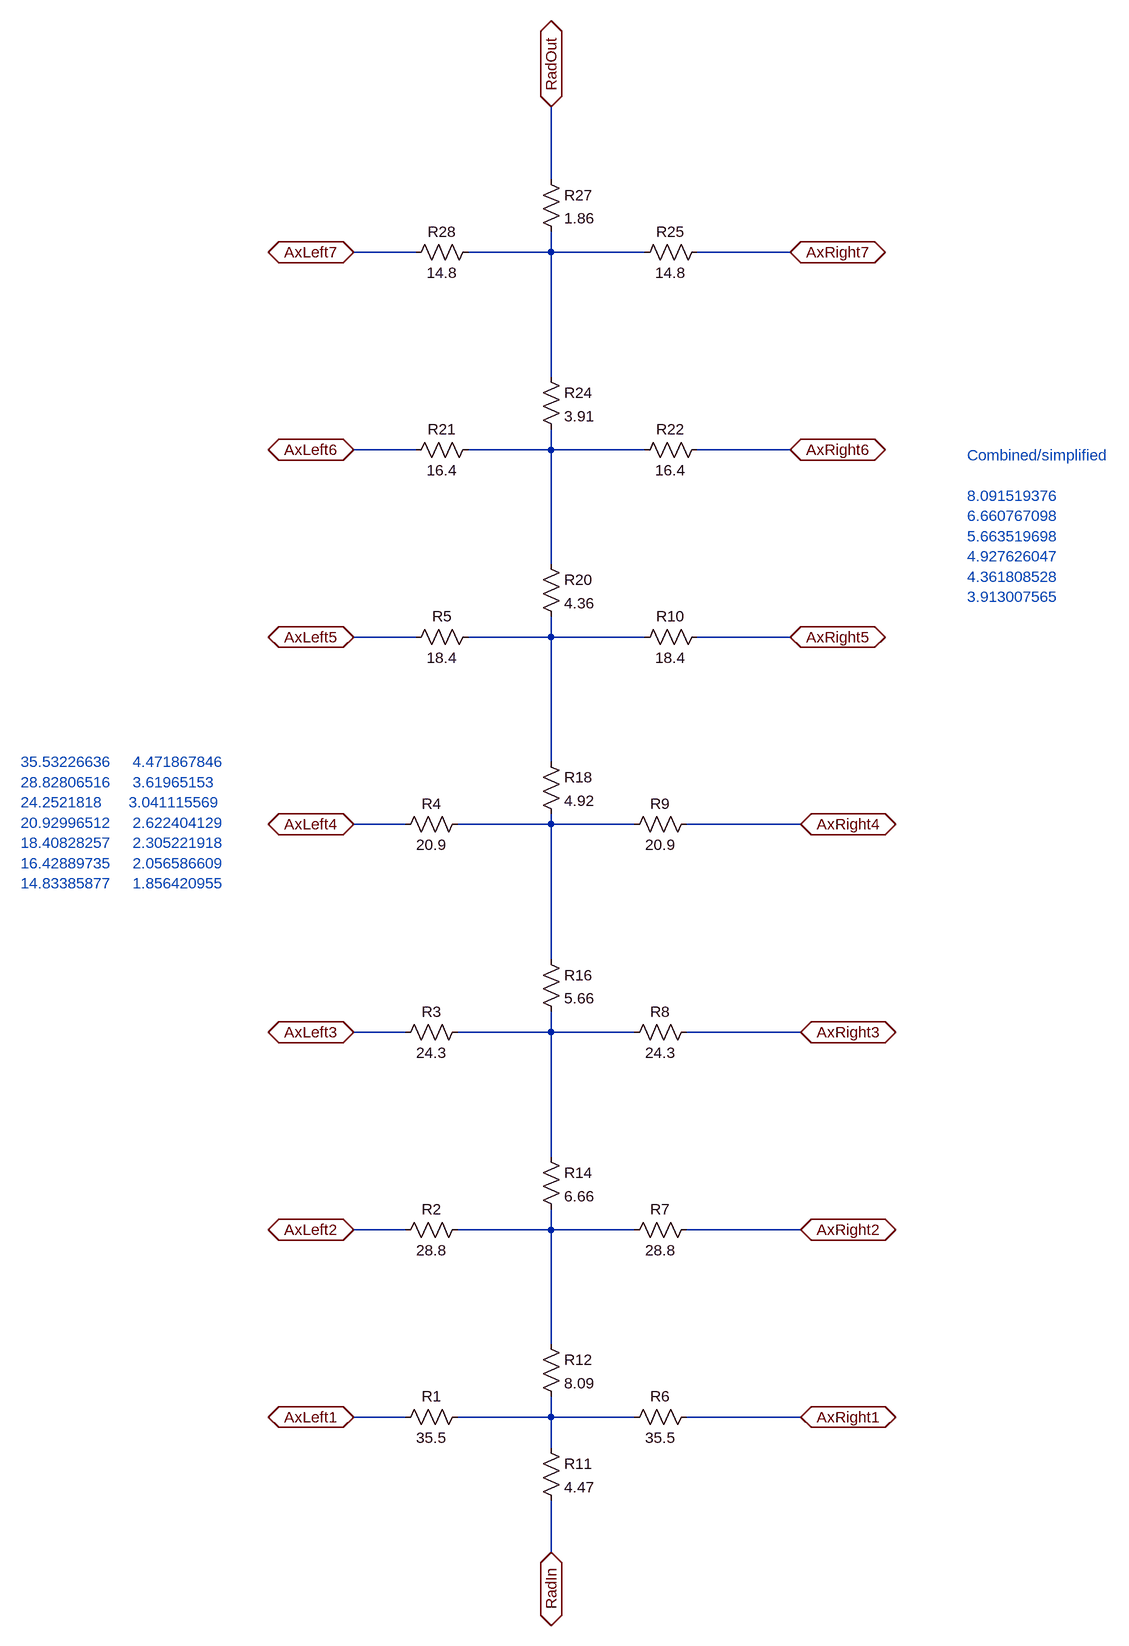
[diagram p0: schematic FarFieldResistance1mm.asc]
FarFieldResistance1mm.asc, the LTspice schematic file:
Version 4
SHEET 1 2344 744
WIRE 528 -1536 528 -1648
WIRE 320 -1424 224 -1424
WIRE 528 -1424 528 -1456
WIRE 528 -1424 400 -1424
WIRE 672 -1424 528 -1424
WIRE 896 -1424 752 -1424
WIRE 528 -1232 528 -1424
WIRE 320 -1120 224 -1120
WIRE 528 -1120 528 -1152
WIRE 528 -1120 400 -1120
WIRE 672 -1120 528 -1120
WIRE 896 -1120 752 -1120
WIRE 528 -944 528 -1120
WIRE 320 -832 224 -832
WIRE 528 -832 528 -864
WIRE 528 -832 400 -832
WIRE 672 -832 528 -832
WIRE 896 -832 752 -832
WIRE 528 -640 528 -832
WIRE 304 -544 224 -544
WIRE 528 -544 528 -560
WIRE 528 -544 384 -544
WIRE 656 -544 528 -544
WIRE 912 -544 736 -544
WIRE 528 -336 528 -544
WIRE 304 -224 224 -224
WIRE 528 -224 528 -256
WIRE 528 -224 384 -224
WIRE 656 -224 528 -224
WIRE 912 -224 736 -224
WIRE 528 -32 528 -224
WIRE 304 80 224 80
WIRE 528 80 528 48
WIRE 528 80 384 80
WIRE 656 80 528 80
WIRE 912 80 736 80
WIRE 528 256 528 80
WIRE 304 368 224 368
WIRE 528 368 528 336
WIRE 528 368 384 368
WIRE 656 368 528 368
WIRE 912 368 736 368
WIRE 528 416 528 368
WIRE 528 576 528 496
FLAG 224 368 AxLeft1
IOPIN 224 368 BiDir
FLAG 224 80 AxLeft2
IOPIN 224 80 BiDir
FLAG 224 -224 AxLeft3
IOPIN 224 -224 BiDir
FLAG 224 -544 AxLeft4
IOPIN 224 -544 BiDir
FLAG 224 -832 AxLeft5
IOPIN 224 -832 BiDir
FLAG 912 368 AxRight1
IOPIN 912 368 BiDir
FLAG 912 80 AxRight2
IOPIN 912 80 BiDir
FLAG 912 -224 AxRight3
IOPIN 912 -224 BiDir
FLAG 912 -544 AxRight4
IOPIN 912 -544 BiDir
FLAG 896 -832 AxRight5
IOPIN 896 -832 BiDir
FLAG 528 576 RadIn
IOPIN 528 576 BiDir
FLAG 224 -1120 AxLeft6
IOPIN 224 -1120 BiDir
FLAG 896 -1120 AxRight6
IOPIN 896 -1120 BiDir
FLAG 528 -1648 RadOut
IOPIN 528 -1648 BiDir
FLAG 224 -1424 AxLeft7
IOPIN 224 -1424 BiDir
FLAG 896 -1424 AxRight7
IOPIN 896 -1424 BiDir
SYMBOL res 752 352 R90
WINDOW 0 0 56 VBottom 0
WINDOW 3 32 56 VTop 0
SYMATTR InstName R6
SYMATTR Value 35.5
SYMBOL res 752 64 R90
WINDOW 0 0 56 VBottom 0
WINDOW 3 32 56 VTop 0
SYMATTR InstName R7
SYMATTR Value 28.8
SYMBOL res 752 -240 R90
WINDOW 0 0 56 VBottom 0
WINDOW 3 32 56 VTop 0
SYMATTR InstName R8
SYMATTR Value 24.3
SYMBOL res 752 -560 R90
WINDOW 0 0 56 VBottom 0
WINDOW 3 32 56 VTop 0
SYMATTR InstName R9
SYMATTR Value 20.9
SYMBOL res 768 -848 R90
WINDOW 0 0 56 VBottom 0
WINDOW 3 32 56 VTop 0
SYMATTR InstName R10
SYMATTR Value 18.4
SYMBOL res 512 400 R0
SYMATTR InstName R11
SYMATTR Value 4.47
SYMBOL res 512 240 R0
SYMATTR InstName R12
SYMATTR Value 8.09
SYMBOL res 512 -48 R0
SYMATTR InstName R14
SYMATTR Value 6.66
SYMBOL res 512 -352 R0
SYMATTR InstName R16
SYMATTR Value 5.66
SYMBOL res 512 -656 R0
SYMATTR InstName R18
SYMATTR Value 4.92
SYMBOL res 512 -960 R0
SYMATTR InstName R20
SYMATTR Value 4.36
SYMBOL res 768 -1136 R90
WINDOW 0 0 56 VBottom 0
WINDOW 3 32 56 VTop 0
SYMATTR InstName R22
SYMATTR Value 16.4
SYMBOL res 512 -1248 R0
SYMATTR InstName R24
SYMATTR Value 3.91
SYMBOL res 400 352 R90
WINDOW 0 0 56 VBottom 0
WINDOW 3 32 56 VTop 0
SYMATTR InstName R1
SYMATTR Value 35.5
SYMBOL res 400 64 R90
WINDOW 0 0 56 VBottom 0
WINDOW 3 32 56 VTop 0
SYMATTR InstName R2
SYMATTR Value 28.8
SYMBOL res 400 -240 R90
WINDOW 0 0 56 VBottom 0
WINDOW 3 32 56 VTop 0
SYMATTR InstName R3
SYMATTR Value 24.3
SYMBOL res 400 -560 R90
WINDOW 0 0 56 VBottom 0
WINDOW 3 32 56 VTop 0
SYMATTR InstName R4
SYMATTR Value 20.9
SYMBOL res 416 -848 R90
WINDOW 0 0 56 VBottom 0
WINDOW 3 32 56 VTop 0
SYMATTR InstName R5
SYMATTR Value 18.4
SYMBOL res 416 -1136 R90
WINDOW 0 0 56 VBottom 0
WINDOW 3 32 56 VTop 0
SYMATTR InstName R21
SYMATTR Value 16.4
SYMBOL res 768 -1440 R90
WINDOW 0 0 56 VBottom 0
WINDOW 3 32 56 VTop 0
SYMATTR InstName R25
SYMATTR Value 14.8
SYMBOL res 512 -1552 R0
SYMATTR InstName R27
SYMATTR Value 1.86
SYMBOL res 416 -1440 R90
WINDOW 0 0 56 VBottom 0
WINDOW 3 32 56 VTop 0
SYMATTR InstName R28
SYMATTR Value 14.8
TEXT -288 -640 Left 0 ;35.53226636     4.471867846\n28.82806516     3.61965153\n24.2521818      3.041115569\n20.92996512     2.622404129\n18.40828257     2.305221918\n16.42889735     2.056586609\n14.83385877     1.856420955
TEXT 1168 -1112 Left 0 ;Combined/simplified\n \n8.091519376\n6.660767098\n5.663519698\n4.927626047\n4.361808528\n3.913007565

The netlist it stands for:
* FarFieldResistance1mm.asc
R6 AxRight1 N007 35.5
R7 AxRight2 N006 28.8
R8 AxRight3 N005 24.3
R9 AxRight4 N004 20.9
R10 AxRight5 N003 18.4
R11 N007 RadIn 4.47
R12 N006 N007 8.09
R14 N005 N006 6.66
R16 N004 N005 5.66
R18 N003 N004 4.92
R20 N002 N003 4.36
R22 AxRight6 N002 16.4
R24 N001 N002 3.91
R1 N007 AxLeft1 35.5
R2 N006 AxLeft2 28.8
R3 N005 AxLeft3 24.3
R4 N004 AxLeft4 20.9
R5 N003 AxLeft5 18.4
R21 N002 AxLeft6 16.4
R25 AxRight7 N001 14.8
R27 RadOut N001 1.86
R28 N001 AxLeft7 14.8
* 35.53226636     4.471867846
* 28.82806516     3.61965153
* 24.2521818      3.041115569
* 20.92996512     2.622404129
* 18.40828257     2.305221918
* 16.42889735     2.056586609
* 14.83385877     1.856420955
* Combined/simplified
* 8.091519376
* 6.660767098
* 5.663519698
* 4.927626047
* 4.361808528
* 3.913007565
.backanno
.end